# Altium schematic sheet PDS1040-131_PDS1040-13.schdoc.schdoc
size 124 x 101 mm
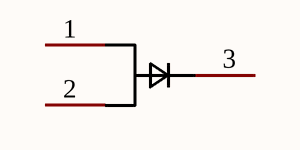
[diagram p0: PDS1040-131_PDS1040-13.schdoc.schdoc]

## Parts
D?  PDS1040-13  [POWERDI-5_L5.4-W4.0-LS6.5-RD]  (value not drawn)

## Nets

Not connected (* = marked no-connect by the designer): D? 1(LEFT) 2(RIGHT) 3

## Library data of the parts
D? = PDS1040-13: Manufacturer: DIODES(美台); Add into BOM: yes; Forward Voltage (Vf@If): 510mV@10A; Reverse Voltage (Vr): 40V; Average Rectified Current (Io): 10A; Symbol: PDS1040-13; Device: PDS1040-13; LCSC Part Name: 电压:40V 电流:10A; Supplier Part: C110512; Manufacturer Part: PDS1040-13; Supplier Footprint: Power-DI-5; JLCPCB Part Class: Extended Part; Datasheet: https://atta.szlcsc.com/upload/public/pdf/source/20170427/1493286399327.pdf; Supplier: LCSC; Convert to PCB: yes